# Altium project SlotMachine_V1.0.PrjPcb
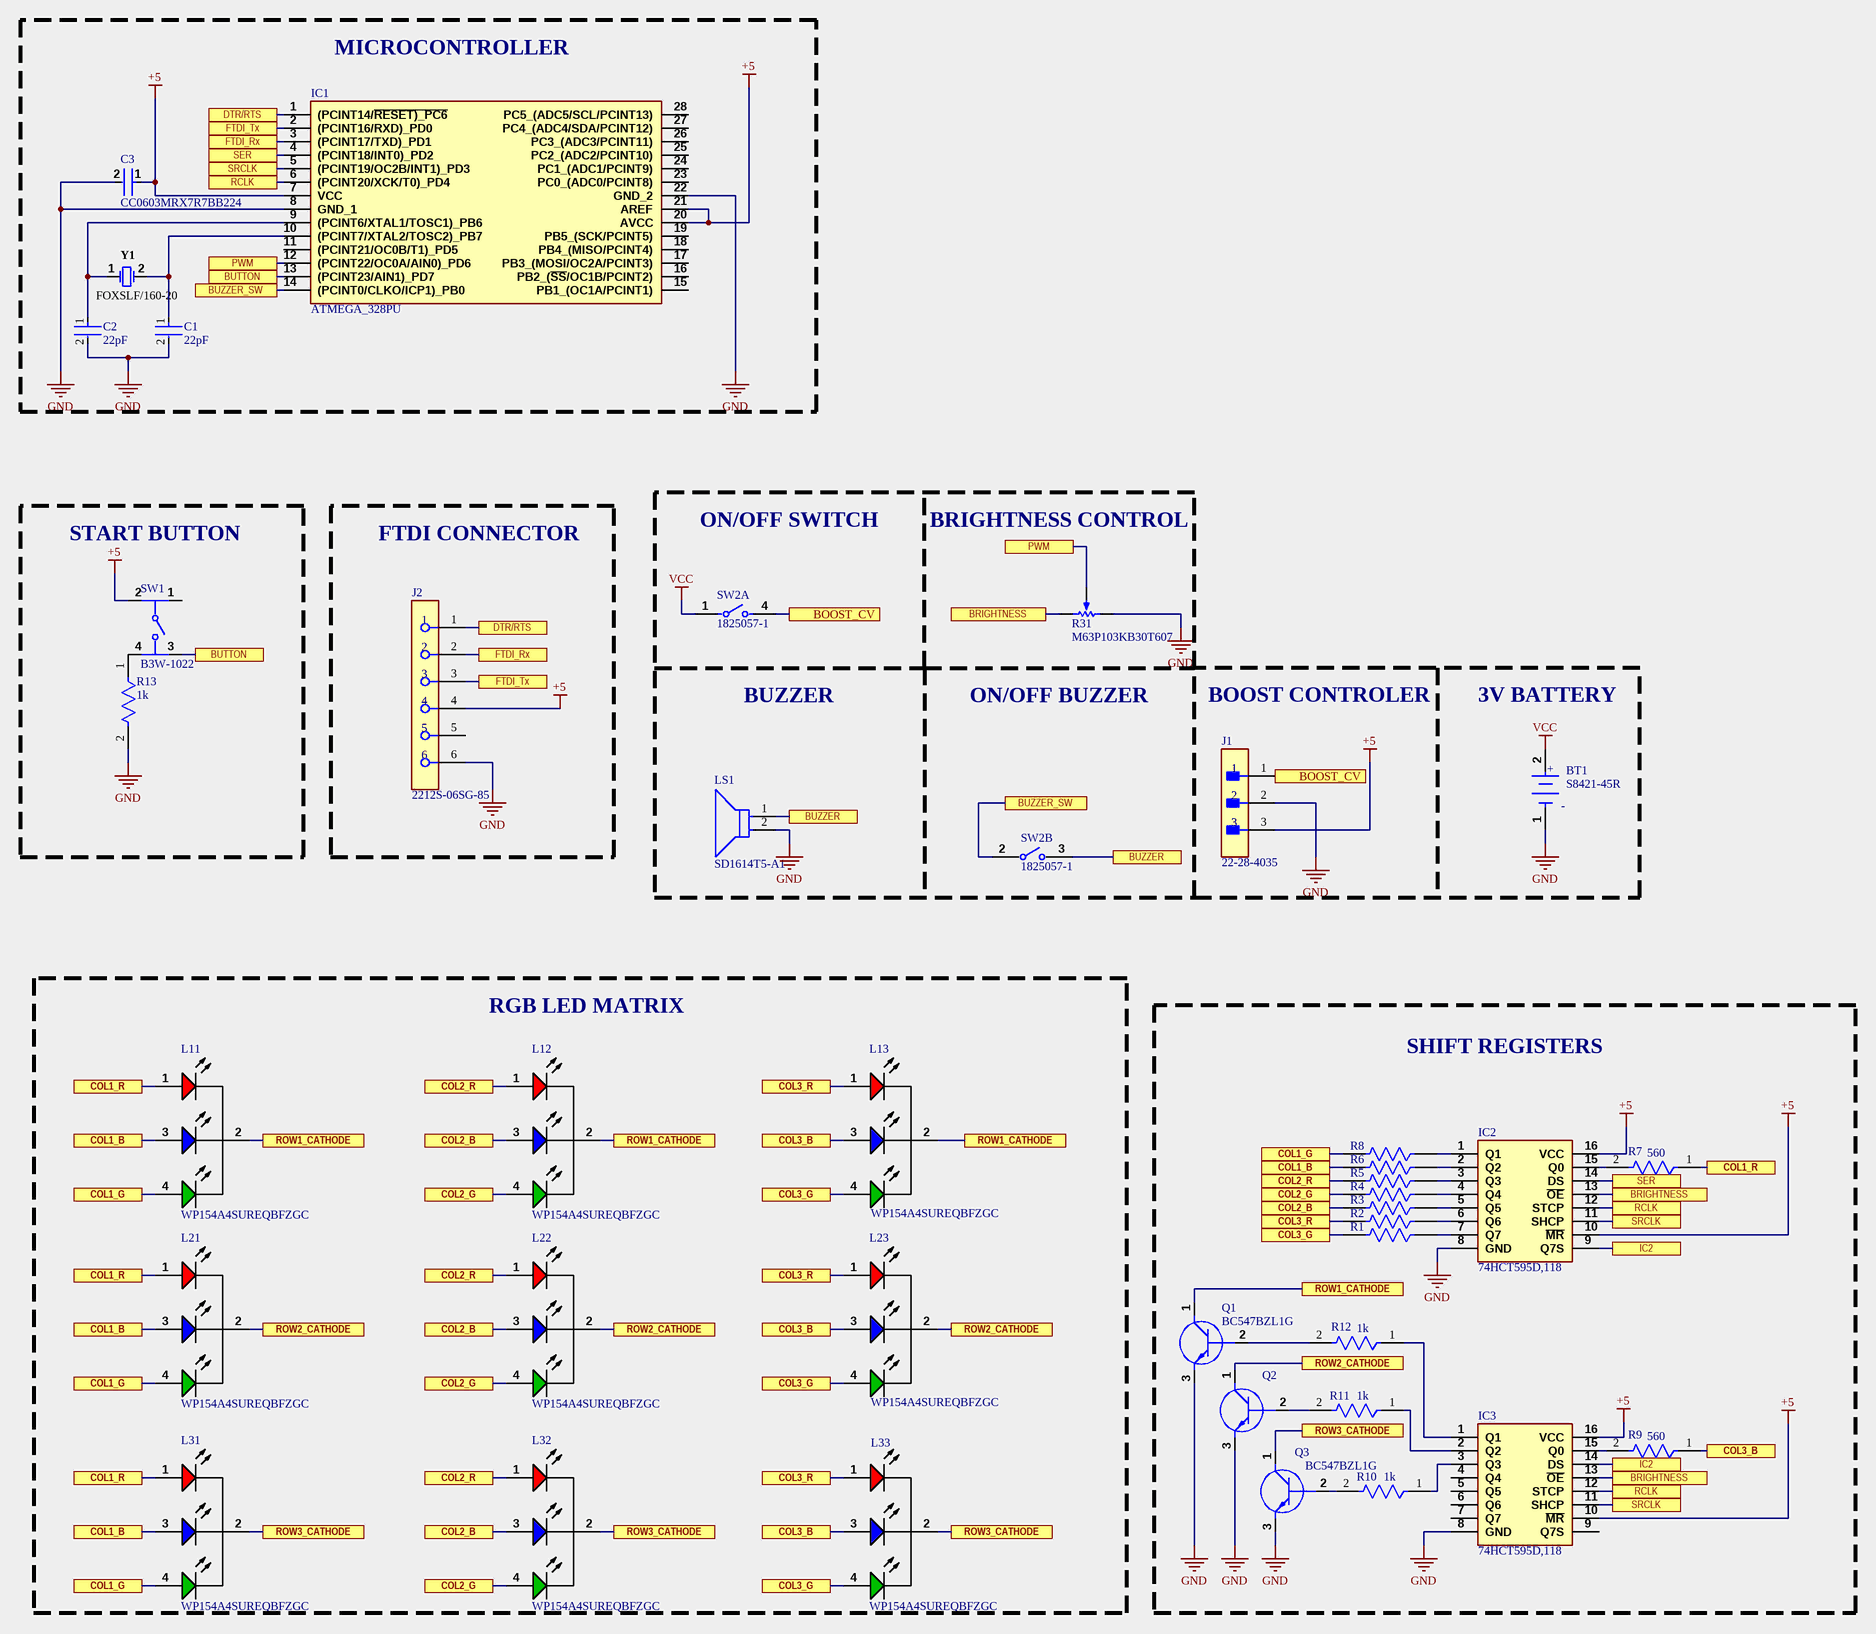
[diagram p0: SlotMachin_V1.0.SchDoc]
1 sheet, 39 parts. Net scope: flat (ports and power ports of the same name join across sheets).
Board file: SlotMachin_V1.0.PcbDoc

## Sheet SlotMachin_V1.0.SchDoc
size OrCAD C; SheetNumber: 1; SheetTotal: 1

### Parts
BT1  S8421-45R  [FP-S8421-45R-MFG]
C1  22pF  [FP-K221K15X7RF5TL2-MFG]
C2  22pF  [FP-K221K15X7RF5TL2-MFG]
C3  CC0603MRX7R7BB224  [FP-CC0603-DA-MFG]
IC1  ATMEGA_328PU  [DIP794W56P254L3486H508Q28N]
IC2  74HCT595D,118  [SOIC127P600X175-16N]
IC3  74HCT595D,118  [SOIC127P600X175-16N]
J1  22-28-4035  [FP-22-28-4035-MFG]
J2  2212S-06SG-85  [FP-2212S-06SG-85-MFG]
L11  WP154A4SUREQBFZGC  [KING-WP154A4SUREQBFZGC_V]
L12  WP154A4SUREQBFZGC  [KING-WP154A4SUREQBFZGC_V]
L13  WP154A4SUREQBFZGC  [KING-WP154A4SUREQBFZGC_V]
L21  WP154A4SUREQBFZGC  [KING-WP154A4SUREQBFZGC_V]
L22  WP154A4SUREQBFZGC  [KING-WP154A4SUREQBFZGC_V]
L23  WP154A4SUREQBFZGC  [KING-WP154A4SUREQBFZGC_V]
L31  WP154A4SUREQBFZGC  [KING-WP154A4SUREQBFZGC_V]
L32  WP154A4SUREQBFZGC  [KING-WP154A4SUREQBFZGC_V]
L33  WP154A4SUREQBFZGC  [KING-WP154A4SUREQBFZGC_V]
LS1  SD1614T5-A1  [FP-SD1614T5-A1-MFG]
Q1  BC547BZL1G  [BC547BZL1G]
Q2  BC547BZL1G  [BC547BZL1G]  (value not drawn)
Q3  BC547BZL1G  [BC547BZL1G]
R1  560  [RESC1608X55N]  (value not drawn)
R2  560  [RESC1608X55N]  (value not drawn)
R3  560  [RESC1608X55N]  (value not drawn)
R4  560  [RESC1608X55N]  (value not drawn)
R5  560  [RESC1608X55N]  (value not drawn)
R6  560  [RESC1608X55N]  (value not drawn)
R7  560  [RESC1608X55N]
R8  560  [RESC1608X55N]  (value not drawn)
R9  560  [RESC1608X55N]
R10  1k  [RESC1608X55N]
R11  1k  [RESC1608X55N]
R12  1k  [RESC1608X55N]
R13  1k  [RESC1608X55N]
R31  M63P103KB30T607  [VISH-M63P103KB30T607]
SW1  B3W-1022  [FP-B3W-1022-MFG]
SW2  1825057-1  [FP-1825057-1-MFG]  (parts A,B of 2)
Y1  FOXSLF/160-20  [FOX-FOXSLF160-20]

### Blocks framed on the sheet
MICROCONTROLLER: C1-C3 IC1 Y1
START BUTTON: R13 SW1
FTDI CONNECTOR: J2
RGB LED MATRIX: L11-L13 L21-L23 L31-L33
SHIFT REGISTERS: IC2 IC3 Q1-Q3 R1-R12

### Ports
BOOST_CV (see Slot[4B]), BOOST_CV (see Slot[5C]), BRIGHTNESS (see Slot[3A], Slot[3B]), BRIGHTNESS (see Slot[3A], Slot[4C]), BRIGHTNESS (see Slot[3B], Slot[4C]), BUTTON (see Slot[6C]), BUZZER (see Slot[4B]), BUZZER (see Slot[5B]), BUZZER_SW (see Slot[4B]), BUZZER_SW (see Slot[6C]), COL1_B (see Slot[4B], Slot[6A]), COL1_B (see Slot[4B], Slot[6A], Slot[6B]), COL1_B (see Slot[6A], Slot[6B]), COL1_G (see Slot[4B], Slot[6A]), COL1_G (see Slot[4B], Slot[6A], Slot[6B]), COL1_G (see Slot[6A], Slot[6B]), COL1_R (see Slot[3B], Slot[6A]), COL1_R (see Slot[3B], Slot[6A], Slot[6B]), COL1_R (see Slot[6A], Slot[6B]), COL2_B (see Slot[4B], Slot[5A]), COL2_B (see Slot[4B], Slot[5A], Slot[5B]), COL2_B (see Slot[5A], Slot[5B]), COL2_G (see Slot[4B], Slot[5A]), COL2_G (see Slot[4B], Slot[5A], Slot[5B]), COL2_G (see Slot[5A], Slot[5B]), COL2_R (see Slot[4B], Slot[5A]), COL2_R (see Slot[4B], Slot[5A], Slot[5B]), COL2_R (see Slot[5A], Slot[5B]), COL3_B (see Slot[3A], Slot[5A]), COL3_B (see Slot[3A], Slot[5A], Slot[5B]), COL3_B (see Slot[5A], Slot[5B]), COL3_G (see Slot[4B], Slot[5A]), COL3_G (see Slot[4B], Slot[5A], Slot[5B]), COL3_G (see Slot[5A], Slot[5B]), COL3_R (see Slot[4B], Slot[5A]), COL3_R (see Slot[4B], Slot[5A], Slot[5B]), COL3_R (see Slot[5A], Slot[5B]), DTR/RTS (see Slot[5C]), DTR/RTS (see Slot[6D]), FTDI_Rx (see Slot[5C]), FTDI_Rx (see Slot[6D]), FTDI_Tx (see Slot[5C]), FTDI_Tx (see Slot[6D]), IC2 (see Slot[3A]), IC2 (see Slot[3B]), PWM (see Slot[4C]), PWM (see Slot[6C]), RCLK (see Slot[3A], Slot[3B]), RCLK (see Slot[3A], Slot[6D]), RCLK (see Slot[3B], Slot[6D]), ROW1_CATHODE (see Slot[4A], Slot[4B], Slot[5B]), ROW1_CATHODE (see Slot[4A], Slot[4B], Slot[6B]), ROW1_CATHODE (see Slot[4A], Slot[5B], Slot[6B]), ROW1_CATHODE (see Slot[4B], Slot[5B], Slot[6B]), ROW2_CATHODE (see Slot[4A], Slot[5A]), ROW2_CATHODE (see Slot[4A], Slot[5A], Slot[6A]), ROW2_CATHODE (see Slot[4A], Slot[6A]), ROW3_CATHODE (see Slot[4A], Slot[5A]), ROW3_CATHODE (see Slot[4A], Slot[5A], Slot[6A]), ROW3_CATHODE (see Slot[4A], Slot[6A]), SER (see Slot[3B]), SER (see Slot[6D]), SRCLK (see Slot[3A], Slot[3B]), SRCLK (see Slot[3A], Slot[6D]), SRCLK (see Slot[3B], Slot[6D])

### Nets
+5: C3.1 IC1.7(VCC) IC1.20(AVCC) IC1.21(AREF) IC2.10(~{MR}) IC2.16(VCC) IC3.10(~{MR}) IC3.16(VCC) J1.3 J2.4 SW1.2
GND: BT1.1(C) C1.2 C2.2 C3.2 IC1.8(GND_1) IC1.22(GND_2) IC2.8(GND) IC3.8(GND) J1.2 J2.6 LS1.2(A) Q1.3(E) Q2.3(E) Q3.3(E) R13.2 R31.1(CCW)
VCC: BT1.2(A) SW2.1
NetC1_1: C1.1 IC1.10((PCINT7/XTAL2/TOSC2)_PB7) Y1.2
NetC2_1: C2.1 IC1.9((PCINT6/XTAL1/TOSC1)_PB6) Y1.1
NetIC1_1: IC1.1((PCINT14/~{RESET)_PC6}) J2.1 ; port DTR/RTS
NetIC1_2: IC1.2((PCINT16/RXD)_PD0) J2.3 ; port FTDI_Tx
NetIC1_3: IC1.3((PCINT17/TXD)_PD1) J2.2 ; port FTDI_Rx
NetIC1_4: IC1.4((PCINT18/INT0)_PD2) IC2.14(DS) ; port SER
NetIC1_5: IC1.5((PCINT19/OC2B/INT1)_PD3) IC2.11(SHCP) IC3.11(SHCP) ; port SRCLK
NetIC1_6: IC1.6((PCINT20/XCK/T0)_PD4) IC2.12(STCP) IC3.12(STCP) ; port RCLK
NetIC1_12: IC1.12((PCINT22/OC0A/AIN0)_PD6) R31.2(S) ; port PWM
NetIC1_13: IC1.13((PCINT23/AIN1)_PD7) SW1.3 ; port BUTTON
NetIC1_14: IC1.14((PCINT0/CLKO/ICP1)_PB0) SW2.2 ; port BUZZER_SW
NetIC2_1: IC2.1(Q1) R8.1
NetIC2_2: IC2.2(Q2) R6.1
NetIC2_3: IC2.3(Q3) R5.1
NetIC2_4: IC2.4(Q4) R4.1
NetIC2_5: IC2.5(Q5) R3.1
NetIC2_6: IC2.6(Q6) R2.1
NetIC2_7: IC2.7(Q7) R1.1
NetIC2_9: IC2.9(Q7S) IC3.14(DS) ; port IC2
NetIC2_13: IC2.13(~{OE}) IC3.13(~{OE}) R31.3(CW) ; port BRIGHTNESS
NetIC2_15: IC2.15(Q0) R7.2
NetIC3_1: IC3.1(Q1) R12.1
NetIC3_2: IC3.2(Q2) R11.1
NetIC3_3: IC3.3(Q3) R10.1
NetIC3_15: IC3.15(Q0) R9.2
NetJ1_1: J1.1 SW2.4 ; port BOOST_CV
NetL11_1: L11.1(RED) L21.1(RED) L31.1(RED) R7.1 ; port COL1_R
NetL11_2: L11.2(CATHODE) L12.2(CATHODE) L13.2(CATHODE) Q1.1(C) ; port ROW1_CATHODE
NetL11_3: L11.3(BLUE) L21.3(BLUE) L31.3(BLUE) R6.2 ; port COL1_B
NetL11_4: L11.4(GREEN) L21.4(GREEN) L31.4(GREEN) R8.2 ; port COL1_G
NetL12_1: L12.1(RED) L22.1(RED) L32.1(RED) R5.2 ; port COL2_R
NetL12_3: L12.3(BLUE) L22.3(BLUE) L32.3(BLUE) R3.2 ; port COL2_B
NetL12_4: L12.4(GREEN) L22.4(GREEN) L32.4(GREEN) R4.2 ; port COL2_G
NetL13_1: L13.1(RED) L23.1(RED) L33.1(RED) R2.2 ; port COL3_R
NetL13_3: L13.3(BLUE) L23.3(BLUE) L33.3(BLUE) R9.1 ; port COL3_B
NetL13_4: L13.4(GREEN) L23.4(GREEN) L33.4(GREEN) R1.2 ; port COL3_G
NetL21_2: L21.2(CATHODE) L22.2(CATHODE) L23.2(CATHODE) Q2.1(C) ; port ROW2_CATHODE
NetL31_2: L31.2(CATHODE) L32.2(CATHODE) L33.2(CATHODE) Q3.1(C) ; port ROW3_CATHODE
NetLS1_1: LS1.1(C) SW2.3 ; port BUZZER
NetQ1_2: Q1.2(B) R12.2
NetQ2_2: Q2.2(B) R11.2
NetQ3_2: Q3.2(B) R10.2
NetR13_1: R13.1 SW1.4

Not connected (* = marked no-connect by the designer): IC1 11((PCINT21/OC0B/T1)_PD5) 15(PB1_(OC1A/PCINT1)) 16(PB2_(~{SS}/OC1B/PCINT2)) 17(PB3_(MOSI/OC2A/PCINT3)) 18(PB4_(MISO/PCINT4)) 19(PB5_(SCK/PCINT5)) 23(PC0_(ADC0/PCINT8)) 24(PC1_(ADC1/PCINT9)) 25(PC2_(ADC2/PCINT10)) 26(PC3_(ADC3/PCINT11)) 27(PC4_(ADC4/SDA/PCINT12)) 28(PC5_(ADC5/SCL/PCINT13)); IC3 4(Q4) 5(Q5) 6(Q6) 7(Q7) 9(Q7S); J2 5; SW1 1

### Notes on the sheet
- ON/OFF SWITCH
- BRIGHTNESS CONTROL
- BUZZER
- ON/OFF BUZZER
- BOOST CONTROLER
- 3V BATTERY
- DWG NO:
- REV:
- THIS DOCUMENT AND THE DATA DISCLOSED HEREIN OR
- HEREWITH IS THE PROPERTY OF ALTIUM LIMITED AND MAY
- BE FREELY DISTRIBUTED IN WHOLE. NO RIGHTS ARE
- RESERVED OR EXPRESS OR IMPLIED WARANTEE GIVEN.
- REVISION
- DESCRIPTION
- DATE
- APPROVED
- ENG:
- APPROVALS
- PROJECT
- DSN:
- CHK:
- REFERENCE DOCUMENTS
- PROJECT REVISION:
- TITLE
- DOCUMENT REVISION:
- DESIGN ITEM:
- BOM:
- FAB DWG:
- PCB DWG:
- ASSY DWG:
- SCALE:
- A2
- SIZE
- CAGE CODE
- FILE NAME
- DWG NO.
- SHEET
- OF
- REV
- (in symbol CMP-2000-07028-3) +; -

### Library data of the parts
BT1 = CMP-2000-07028-3: BATTERY HOLDER COIN 20MM SMD; Number of Cells: 1; Min Operating Temperature: -40°C; Packaging: Tape and Reel; Max Operating Temperature: 105°C; Number of Batteries: 1; Package Quantity: 500; Material: Polyphenylene; Case/Package: SMD/SMT; Mount: Surface Mount; REACH SVHC: No SVHC; Contact Plating: Bronze; Termination: SMD/SMT
C1 C2 = CMP-00030-39474895-1: K221K15X7RF5TL2 Multilayer Ceramic Capacitor, 220 pF, 50 V, ± 10%, X7R, Radial Leaded; Voltage Rating (DC): 50V; Lead Diameter: 500µm; Lead Length: 30mm; Lead/Base Style: Straight; Capacitance: 220pF; REACH SVHC: Unknown; Tolerance: 10%; Radiation Hardening: No; Depth: 2.6mm; Packaging: Cut Tape; Dielectric Material: Ceramic; Height: 4mm; Dielectric: X7R; Thickness: 2.6mm; Max Operating Temperature: 125°C; Weight: 160.004709mg; Height - Seated (Max): 5.588mm; Length: 4mm; Min Operating Temperature: -55°C; Case/Package: Dipped; Mount: Through Hole; Width: 2.4892mm; Number of Pins: 2; Diameter: 500µm; Voltage Rating: 50V; Termination: Radial; NexarPartId: 39474895; Lead Pitch: 2.5mm; RoHS: Compliant
C3 = CMP-03422-001274-1: CAP CER 0.22UF 16V X7R 0603; Manufacturer: YAGEO; Material: Ceramic; Temperature Coefficient: 15%; Tolerance: 0.2; Capacitance: 220 nF; Value: 220 nF; Voltage Rating: 16 V; Category: Cap; Lead Free: Yes; Voltage: 16 V; RoHS: TRUE; ComponentLink2URL: http://www.yageo.com/documents/recent/UPY-GPHC_X7R_6.3V-to-50V_18.pdf; Temperature Range High: +125°C; Footprint Url: http://www.yageo.com/exep/pages/download/literatures/UPY-C_GEN_24.pdf; Mouser Description: Multilayer Ceramic Capacitors MLCC - SMD/SMT 220nF 16V X7R 20%; Temperature: -55°C to +125°C; Octopart: https://octopart.com/cc0603mrx7r7bb224-yageo-38999050; Temperature Range Low: -55°C; ComponentLink2Description: Datasheet; Height: 0.9mm; Device Class L2: Capacitors; Digikey Description: CAP CER 0.22UF 16V X7R 0603; Package: CC0603-DA; Temperature Characteristic: X7R; Device Class L1: Passive Components; Manufacturer Part Number: CC0603MRX7R7BB224; Device Class L3: Ceramic Capacitors; Automotive: No
IC1 = ATMEGA_328PU: Integrated Circuit; Manufacturer_Name: Microchip; Manufacturer_Part_Number: ATMEGA 328PU; Datasheet Link: https://ww1.microchip.com/downloads/en/DeviceDoc/ATmega48A-PA-88A-PA-168A-PA-328-P-DS-DS40002061B.pdf; Height: 5.08mm
IC2 IC3 = 74HCT595D,118: Integrated Circuit; Manufacturer_Name: Nexperia; Datasheet Link: https://assets.nexperia.com/documents/data-sheet/74HC_HCT595.pdf; Height: 1.75mm; Manufacturer_Part_Number: 74HCT595D,118; Mouser Part Number: 771-74HCT595D-T; Mouser Price/Stock: https://www.mouser.co.uk/ProductDetail/Nexperia/74HCT595D118?qs=me8TqzrmIYVM2xcL0YiJEg%3D%3D; Arrow Part Number: 74HCT595D,118; Arrow Price/Stock: https://www.arrow.com/en/products/74hct595d118/nexperia?region=europe
J1 = CMP-00257-00247547-1: 22-28-4035 BOARD-BOARD Connector HEADER, 3WAY, 1ROW; Series: KK; Pitch Spacing: 2.54mm; No. of Rows: 1;; Manufacturer Lifecycle Status: ACTIVE; NexarPartId: 247547; Plating: Tin; Max Voltage Rating (DC): 250.25kV; Voltage Rating: 250V; Current Rating: 4A; Gender: Male; Glow Wire Compliant: Non-compliant; Number of Positions: 3; Connector Type: Male Pin; Contact Resistance: 20mΩ; Color: Black; Contact Plating: Gold; Contact Material: Brass; Lead Free: Lead Free; Number of Rows: 1; Housing Material: Thermoplastic; Min Operating Temperature: 0°C; Country of Origin: US; REACH SVHC: Unknown; Lifecycle Status: Production; Mount: Through Hole; Schedule B: 8536694040; RoHS: Compliant; Termination: Through Hole; Max Operating Temperature: 75°C; Pitch: 2.54mm; Packaging: Bulk; Number of Circuits: 3; Contact Mating Length: 7.493mm; Orientation: Vertical; Housing Color: Black; Number of Contacts: 3
J2 = CMP-12414-000007-1: Header, Rectangular, 6 Positions, Receptacle, 2.54mm pitch, Vertical, Through-Hole; Number of Contacts: 6; Insulation Resistance: 1GR; Number of Rows: 1; Width: 0.12inch; Flammability Rating: UL94 V-0; Contact Plating: Gold; REACH SVHC: No SVHC; Contact Material: Bronze; Weight: 0.11lb; Height: 0.35inch; Length: 0.63inch; Mount: Through Hole; Termination: Through Hole; RoHS Compliant: Yes; Gender: Receptacle
L11-L13 L21-L23 L31-L33 = CMP-2000-07415-1: Full Color LED Lamp, Dominant Wavelength RGB 630 / 525 / 465 nm, -40 to 85 degC, 4-Pin THD, RoHS; Manufacturer: Kingbright; Viewing Angle: 50°; Wavelength - Dominant: 630nm,525nm,465nm; Online Catalog: 5mm,T-13/4(RGB)RoundwithDomedTopLEDLamp; Millicandela Rating: 1300mcdRed,1700mcdGreen,900mcdBlue; Other Names: 754-1615 / WP154A4SUREQBFZGC-ND; Current - Test: 20mA; Wavelength - Peak: 645nm,515nm,460nm; Color: Red,Green,Blue(RGB); Voltage - Forward (Vf) (Typ): 1.9VRed,3.3VGreen,3.3VBlue; Lens Type: Clear; 3D Model: WP154A4SUREQBFZGW.sldprt / WP154A4SUREQBFZGW.pro / WP154A4SUREQBFZGW.igs / WP154A4SUREQBFZGW.stp; Lens Style/Size: RoundwithDomedTop,5mm,T-13/4; Packaging: Bulk; Datasheet URL: https://www.kingbrightusa.com/images/catalog/spec/WP154A4SUREQBFZGC.pdf; Family: LEDIndication-Discrete; Datasheet Version: Rev. 5A, 08/2014; Category: Optoelectronics; Manufacturer URL: http://www.kingbright.com/; Height: 8.60mm; Mounting Type: ThroughHole; Package Reference: WP154A4SUREQBFZGC; Mounting Technology: ThroughHole; Package Description: 4-Pin Through Hole LED, Dia 5.9 mm, Pitch 1.27 mm; Standard Package: 500; Package / Case: Radial-4Leads
LS1 = CMP-08413-000005-1: BUZZER MAGNETIC 5V 80DB 2048HZ 1; Frequency: 2.048kHz; Operating Supply Current: 80mA; Max Operating Temperature: 85°C; Min Operating Temperature: -40°C; Voltage Rating: 5V; Termination: PC Pins; Sensing Method: Magnetic; Mount: Panel
Q1-Q3 = BC547BZL1G: Transistor BJT NPN; Manufacturer_Name: onsemi; Datasheet Link: https://www.onsemi.com/download/data-sheet/pdf/BC546-D.PDF; Height: 9.33mm; Manufacturer_Part_Number: BC547BZL1G; Mouser Part Number: 863-BC547BZL1G; Mouser Price/Stock: https://www.mouser.com/Search/Refine.aspx?Keyword=863-BC547BZL1G; Arrow Part Number: BC547BZL1G; Arrow Price/Stock: https://www.arrow.com/en/products/bc547bzl1g/on-semiconductor?region=nac
R1-R13 = CPF0603B12RE: Resistor; Manufacturer_Name: TE Connectivity; Datasheet Link: http://www.farnell.com/datasheets/1786775.pdf; Height: 0.55mm; Manufacturer_Part_Number: CPF0603B12RE
R31 = CMP-1666-00012-6: Single-Turn Cermet Trimmer, 10 KOhm, -55 to 125 degC, 3-Pin THD, RoHS, Bulk; Manufacturer: Vishay Semiconductor; Mounting Technology: Through Hole; DatasheetVersion: 09/2015; ComponentLink2Description: Datasheet; ComponentLink1Description: Manufacturer URL; ComponentLink1URL: http://www.vishay.com/; ComponentLink2URL: http://120.52.73.14/www.mouser.com/ds/2/427/63-239923.pdf; PackageDescription: 3-Pin Through Hole Device, Body 9.52 x 9.52 mm, Pitch 2.54 mm; PackageReference: M63P103KB30T607
SW1 = CMP-08834-000055-1: SWITCH TACTILE SPST-NO 0.05A 24V; Operating Force: 230gf; Switch Function: Off-Mom; Switch Travel: 0.25mm; Throw Configuration: SPST; Actuator Type: Standard; Illumination Type: Non-Illuminated; Ratings: IP67; Mechanical Life: 1000000Cycles; Packaging: Bulk; Termination: PC Pin; Max Operating Temperature: 70°C; RoHS Compliant: Yes; Mount: Through Hole; Min Operating Temperature: -25°C
SW2 = CMP-03400-000012-1: SWITCH SLIDE DIP SPST 100MA 24V; Manufacturer: TE Connectivity; Contact Resistance: 50mΩ; Electromechanical Life: 1000Cycles; Standoff Height: 1.3mm; Number Of Circuits: 2; Contact Current Rating: 100mA; ComponentLink2URL: https://www.te.com/commerce/DocumentDelivery/DDEController?Action=srchrtrv&DocNm=1825057&DocType=Customer+Drawing&DocLang=English; Digikey Description: SWITCH SLIDE DIP SPST 100MA 24V; Temperature: -30°C to +85°C; Lead Free: Yes; ComponentLink2Description: Datasheet; Octopart: https://octopart.com/1825057-1-te+connectivity-46507313; Manufacturer Part Number: 1825057-1; Automotive: No; Voltage Rating Dc: 24V; RoHS: TRUE; Package: 1825057-1; Device Class L1: Electromechanical; Temperature Range Low: -30°C; Device Class L2: Switches; Mount: Through Hole; Device Class L3: DIP Switches; Height: 6.15mm; Category: Switch; Temperature Range High: +85°C; Throw Configuration: SPST
Y1 = CMP-1749-00003-1: Resistance Weld Thru-Hole Crystal, 16 MHz, -20 to 70 degC, 2-Pin THD, RoHS, Bulk; Voltage Rating: 250 V; Tolerance: 1%; Resistance: 221 kohm; Case\Package: Axial; Power Rating: 250 mW; RoHSCompliant: true; Package Quantity: 200; Packaging: Bulk; Min Operating Temperature: -55 degC; DatasheetVersion: Mar-15; ComponentLink1URL: http://www.foxonline.com/; Max Operating Temperature: 155 degC; PackageReference: FOXSLF160-20; Mount: Through Hole; PackageDescription: 2-Pin Through Hole Device, Body 11.35 x 4.65 mm; ComponentLink1Description: Manufacturer URL; ComponentLink2URL: http://www.foxonline.com/pdfs/hc49slf.pdf; ComponentLink2Description: Datasheet; Length: 0.248 inch